# EAGLE schematic threestate driver (EAGLE 6.5.0)
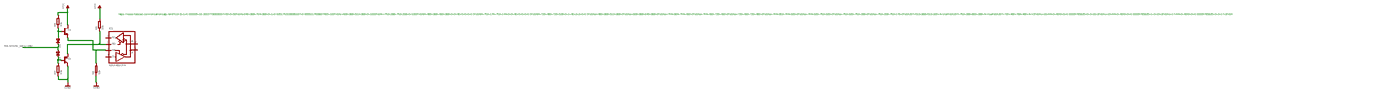
[diagram p0: schematic, sheet 1, overview]
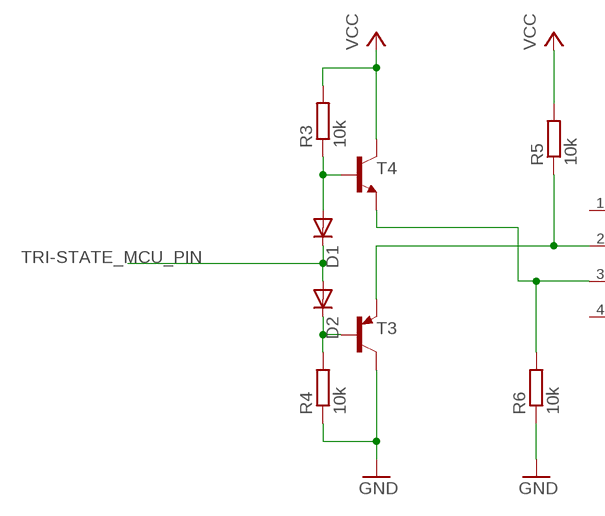
[diagram p1: schematic, sheet 1, part 1 of 4]
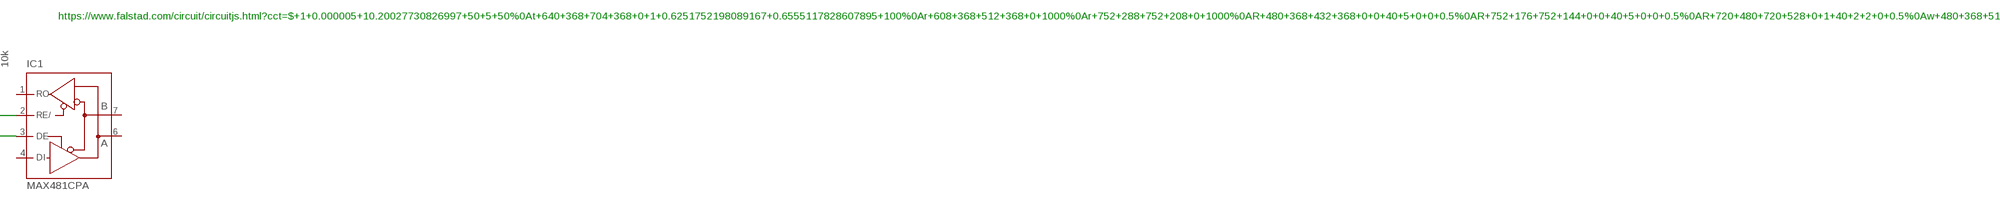
[diagram p2: schematic, sheet 1, part 2 of 4]
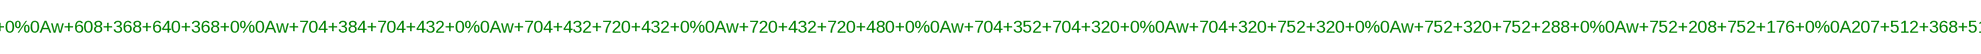
[diagram p3: schematic, sheet 1, part 3 of 4]
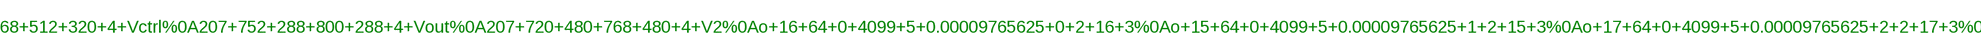
[diagram p4: schematic, sheet 1, part 4 of 4]

## Parts
D1  1N4148DO35-10  [DO35-10]
D2  1N4148DO35-10  [DO35-10]
IC1  MAX481CPA  [DIL08]
R3  10k  R-EU_R0805  [R0805]
R4  10k  R-EU_R0805  [R0805]
R5  10k  R-EU_R0805  [R0805]
R6  10k  R-EU_R0805  [R0805]
T3  -PNP-TO92  [TO92]
T4  -NPN-TO92  [TO92]

## Nets
GND: R4.1 R6.1 T3.3(C)
N$1: IC1.2(RE/) R5.1 T3.1(E)
N$2: D1.A R3.1 T4.2(B)
N$3: IC1.3(DE) R6.2 T4.1(E)
N$4: D2.C R4.2 T3.2(B)
TRI-STATE_MCU_PIN: D1.C D2.A
VCC: R3.2 R5.2 T4.3(C)
Unconnected: IC1.1(RO) IC1.4(DI) IC1.6(A) IC1.7(B)

## Notes on the sheet
- https://www.falstad.com/circuit/circuitjs.html?cct=$+1+0.000005+10.20027730826997+50+5+50%0At+640+368+704+368+0+1+0.6251752198089167+0.6555117828607895+100%0Ar+608+368+512+368+0+1000%0Ar+752+288+752+208+0+1000%0AR+480+368+432+368+0+0+40+5+0+0+0.5%0AR+752+176+752+144+0+0+40+5+0+0+0.5%0AR+720+480+720+528+0+1+40+2+2+0+0.5%0Aw+480+368+512+368+0%0Aw+608+368+640+368+0%0Aw+704+384+704+432+0%0Aw+704+432+720+432+0%0Aw+720+432+720+480+0%0Aw+704+352+704+320+0%0Aw+704+320+752+320+0%0Aw+752+320+752+288+0%0Aw+752+208+752+176+0%0A207+512+368+512+320+4+Vctrl%0A207+752+288+800+288+4+Vout%0A207+720+480+768+480+4+V2%0Ao+16+64+0+4099+5+0.00009765625+0+2+16+3%0Ao+15+64+0+4099+5+0.00009765625+1+2+15+3%0Ao+17+64+0+4099+5+0.00009765625+2+2+17+3%0A

## Power pins joined to a net without a drawn wire
GND: IC1.5(GND)
VCC: IC1.8(VCC)

## Library data of the parts
D1 D2 = diode:1N4148: DIODE high speed (Philips)
IC1 = maxim:MAX481CPA: RS485 TRANSEIVER; MPN: MAX481CPA+; OC_FARNELL: unknown; OC_NEWARK: 99K3445
R3-R6 = rcl:R-EU_: RESISTOR, European symbol
T3 = transistor:*-PNP-: PNP Transistror
T4 = transistor:*-NPN-: NPN Transistror BF959 corrected 2008.03.06